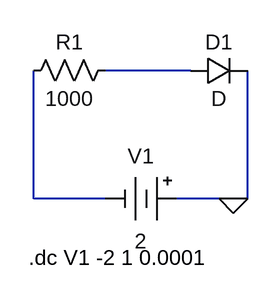
[diagram p0: schematic VI_Diode_pn_Reverse.asc]
VI_Diode_pn_Reverse.asc, the LTspice schematic file:
Version 4
SHEET 1 880 680
WIRE 224 112 128 112
WIRE 48 256 48 112
WIRE 128 256 48 256
WIRE 272 256 208 256
WIRE 288 256 288 112
WIRE 288 256 272 256
FLAG 272 256 0
SYMBOL res 144 96 R90
WINDOW 0 0 56 VBottom 2
WINDOW 3 32 56 VTop 2
SYMATTR InstName R1
SYMATTR Value 1000
SYMBOL diode 224 128 R270
WINDOW 0 32 32 VTop 2
WINDOW 3 0 32 VBottom 2
SYMATTR InstName D1
SYMBOL Misc\\battery 224 256 R90
WINDOW 0 -32 56 VBottom 2
WINDOW 3 32 56 VTop 2
SYMATTR InstName V1
SYMATTR Value 2
TEXT 42 322 Left 2 !.dc V1 -2 1 0.0001

The netlist it stands for:
* VI_Diode_pn_Reverse.asc
R1 N001 N002 1000
D1 N001 0 D
V1 0 N002 2
.model D D
.lib standard.dio
.dc V1 -2 1 0.0001
.backanno
.end